# Altium schematic sheet face_board.SchDoc
size A3
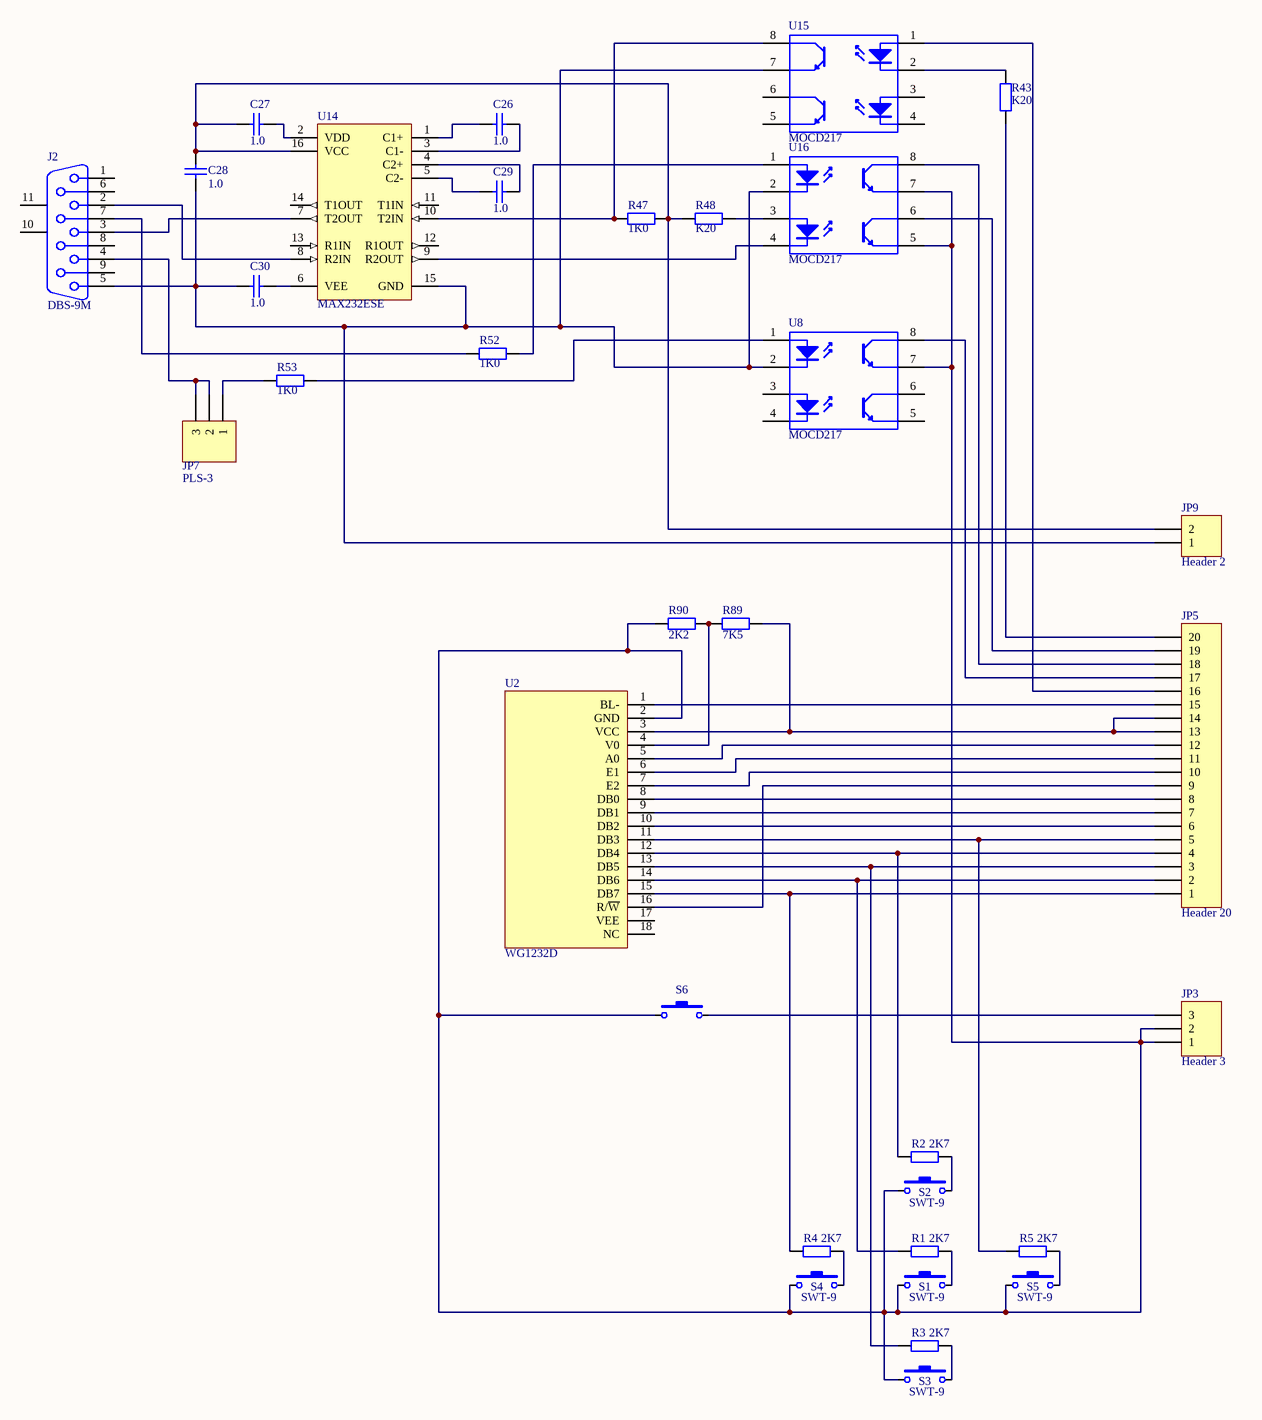
[diagram p0: face_board.SchDoc]

## Parts
C26  1.0  [C3216-1206]
C27  1.0  [_1206]
C28  1.0  [C3216-1206]
C29  1.0  [C3216-1206]
C30  1.0  [C3216-1206]
J2  DBS-9M  [DSUB_N9]
JP3  Header 3  [HDR1X3]
JP5  Header 20  [HDR1X20]
JP7  PLS-3  [HDR1X3]
JP9  Header 2  [HDR1X2]
R1  2K7  [_1206]
R2  2K7  [_1206]
R3  2K7  [_1206]
R4  2K7  [_1206]
R5  2K7  [_1206]
R43  K20  [_1206]
R47  1K0  [_1206]
R48  K20  [_1206]
R52  1K0  [_1206]
R53  1K0  [_1206]
R89  7K5  [_1206]
R90  2K2  [_1206]
S1  SWT-9  [SWT-9]
S2  SWT-9  [SWT-9]
S3  SWT-9  [SWT-9]
S4  SWT-9  [SWT-9]
S5  SWT-9  [SWT-9]
S6  SWT-6  [SWT-6]  (value not drawn)
U2  WG1232D  [WG1232D]
U8  MOCD217  [SO-G8]
U14  MAX232ESE  [SO-G16]
U15  MOCD217  [SO-G8]
U16  MOCD217  [SO-G8]

## Nets
NetC26_1: C26.1 U14.3(C1-)
NetC26_2: C26.2 U14.1(C1+)
NetC27_1: C27.1 U14.2(VDD)
NetC27_2: C27.2 C28.1 JP9.2 R47.1 R48.2 U14.16(VCC)
NetC28_2: C28.2 C30.2 J2.5 JP9.1 U8.2(K) U14.15(GND) U15.7(E) U16.2(K)
NetC29_1: C29.1 U14.4(C2+)
NetC29_2: C29.2 U14.5(C2-)
NetC30_1: C30.1 U14.6(VEE)
NetJ2_2: J2.2 U14.8(R2IN)
NetJ2_3: J2.3 U14.7(T2OUT)
NetJ2_4: J2.4 JP7.2 JP7.3
NetJ2_7: J2.7 R52.2
NetJP3_1: JP3.1 JP3.2 R90.2 S1.1 S2.1 S3.1 S4.1 S5.1 S6.1 U2.2(GND) U8.7(E) U16.5(E) U16.7(E)
NetJP3_3: JP3.3 S6.2
NetJP5_1: JP5.1 R4.2 U2.15(DB7)
NetJP5_2: JP5.2 R1.2 U2.14(DB6)
NetJP5_3: JP5.3 R3.2 U2.13(DB5)
NetJP5_4: JP5.4 R2.2 U2.12(DB4)
NetJP5_5: JP5.5 R5.2 U2.11(DB3)
NetJP5_6: JP5.6 U2.10(DB2)
NetJP5_7: JP5.7 U2.9(DB1)
NetJP5_8: JP5.8 U2.8(DB0)
NetJP5_9: JP5.9 U2.16(R/~{W})
NetJP5_10: JP5.10 U2.7(E2)
NetJP5_11: JP5.11 U2.6(E1)
NetJP5_12: JP5.12 U2.5(A0)
NetJP5_13: JP5.13 JP5.14 R89.1 U2.3(VCC)
NetJP5_15: JP5.15 U2.1(BL-)
NetJP5_16: JP5.16 U15.1(A)
NetJP5_17: JP5.17 U8.8(C)
NetJP5_18: JP5.18 U16.8(C)
NetJP5_19: JP5.19 U16.6(C)
NetJP5_20: JP5.20 R43.1
NetJP7_1: JP7.1 R53.2
NetR1_1: R1.1 S1.2
NetR2_1: R2.1 S2.2
NetR3_1: R3.1 S3.2
NetR4_1: R4.1 S4.2
NetR5_1: R5.1 S5.2
NetR43_2: R43.2 U15.2(K)
NetR47_2: R47.2 U14.10(T2IN) U15.8(C)
NetR48_1: R48.1 U16.3(A)
NetR52_1: R52.1 U16.1(A)
NetR53_1: R53.1 U8.1(A)
NetR89_2: R89.2 R90.1 U2.4(V0)
NetU14_9: U14.9(R2OUT) U16.4(K)

Not connected (* = marked no-connect by the designer): J2 1 6 8 9 10(MH1) 11(MH2); U2 17(VEE) 18(NC); U8 3(A) 4(K) 5(E) 6(C); U14 11(T1IN) 12(R1OUT) 13(R1IN) 14(T1OUT); U15 3(A) 4(K) 5(E) 6(C)

## Library data of the parts
C26-C30 = Cap Semi: Capacitor (Semiconductor SIM Model); Manufacturer: Generic Components; Class I: Passive; Value: 1,0; Published: 8-Jun-2000; Revision: July-2002: Re-released for DXP Platform.; Publisher: Altium Limited; Class II: Capacitor
J2 = D Connector 9: Receptacle Assembly, 9 Position, Right Angle; Manufacturer: Generic Components; Package Information: Latest Revision: O; Positions: 9; Published: 15-Jun-2001; Revision: July-2002: Re-released for DXP Platform.; Datasheet: (1-Sep-1999); Package Reference: 788750; Publisher: Altium Limited; Class I: Connector; Orientation: Right Angle; Gender: Receptacle
JP3 JP7 = Header 3: Header, 3-Pin; Manufacturer: Generic Components; Class I: Connector; Revision: July-2002: Re-released for DXP Platform.; Publisher: Altium Limited
JP5 = Header 20: Header, 20-Pin; Manufacturer: Generic Components; Class I: Connector; Revision: July-2002: Re-released for DXP Platform.; Publisher: Altium Limited
JP9 = Header 2: Header, 2-Pin; Manufacturer: Generic Components; Class I: Connector; Revision: July-2002: Re-released for DXP Platform.; Publisher: Altium Limited
R1-R5 R47 R52 R53 R89 R90 = Res2: Resistor; Manufacturer: Generic Components; Class I: Passive; Rule: Undefined; Published: 8-Jun-2000; Revision: July-2002: Re-released for DXP Platform.; Publisher: Altium Limited; Class II: Resistor
  R1-R5: Value: 2K7
  R47 R52 R53: Value: 1K0
  R89: Value: 7K5
  R90: Value: 2K2
R43 R48 = Res2: Resistor; Manufacturer: Generic Components; Class I: Passive; Value: 200R; Rule: Undefined; Published: 8-Jun-2000; Revision: July-2002: Re-released for DXP Platform.; Publisher: Altium Limited; Class II: Resistor
S1-S5 = SWT-9: Switch; Manufacturer: Generic Components; Published: 24-Mar-1999; Revision: July-2002: Re-released for DXP Platform.; Publisher: Altium Limited
S6 = SWT-9: Button; Manufacturer: Generic Components; Published: 24-Mar-1999; Revision: July-2002: Re-released for DXP Platform.; Publisher: Altium Limited; Value: SWT-6
U14 = MAX232ESE: +5V Powered, Multi-Channel RS-232 Driver/Receiver; Manufacturer: Maxim; Class I: Communication; Class II: Transceiver; Published: 16-Jan-2001; Revision: July-2002: Re-released for DXP Platform.; Package Reference: NSO16; Publisher: Altium Limited